# EAGLE design finalproject_2 (EAGLE 9.6.2)
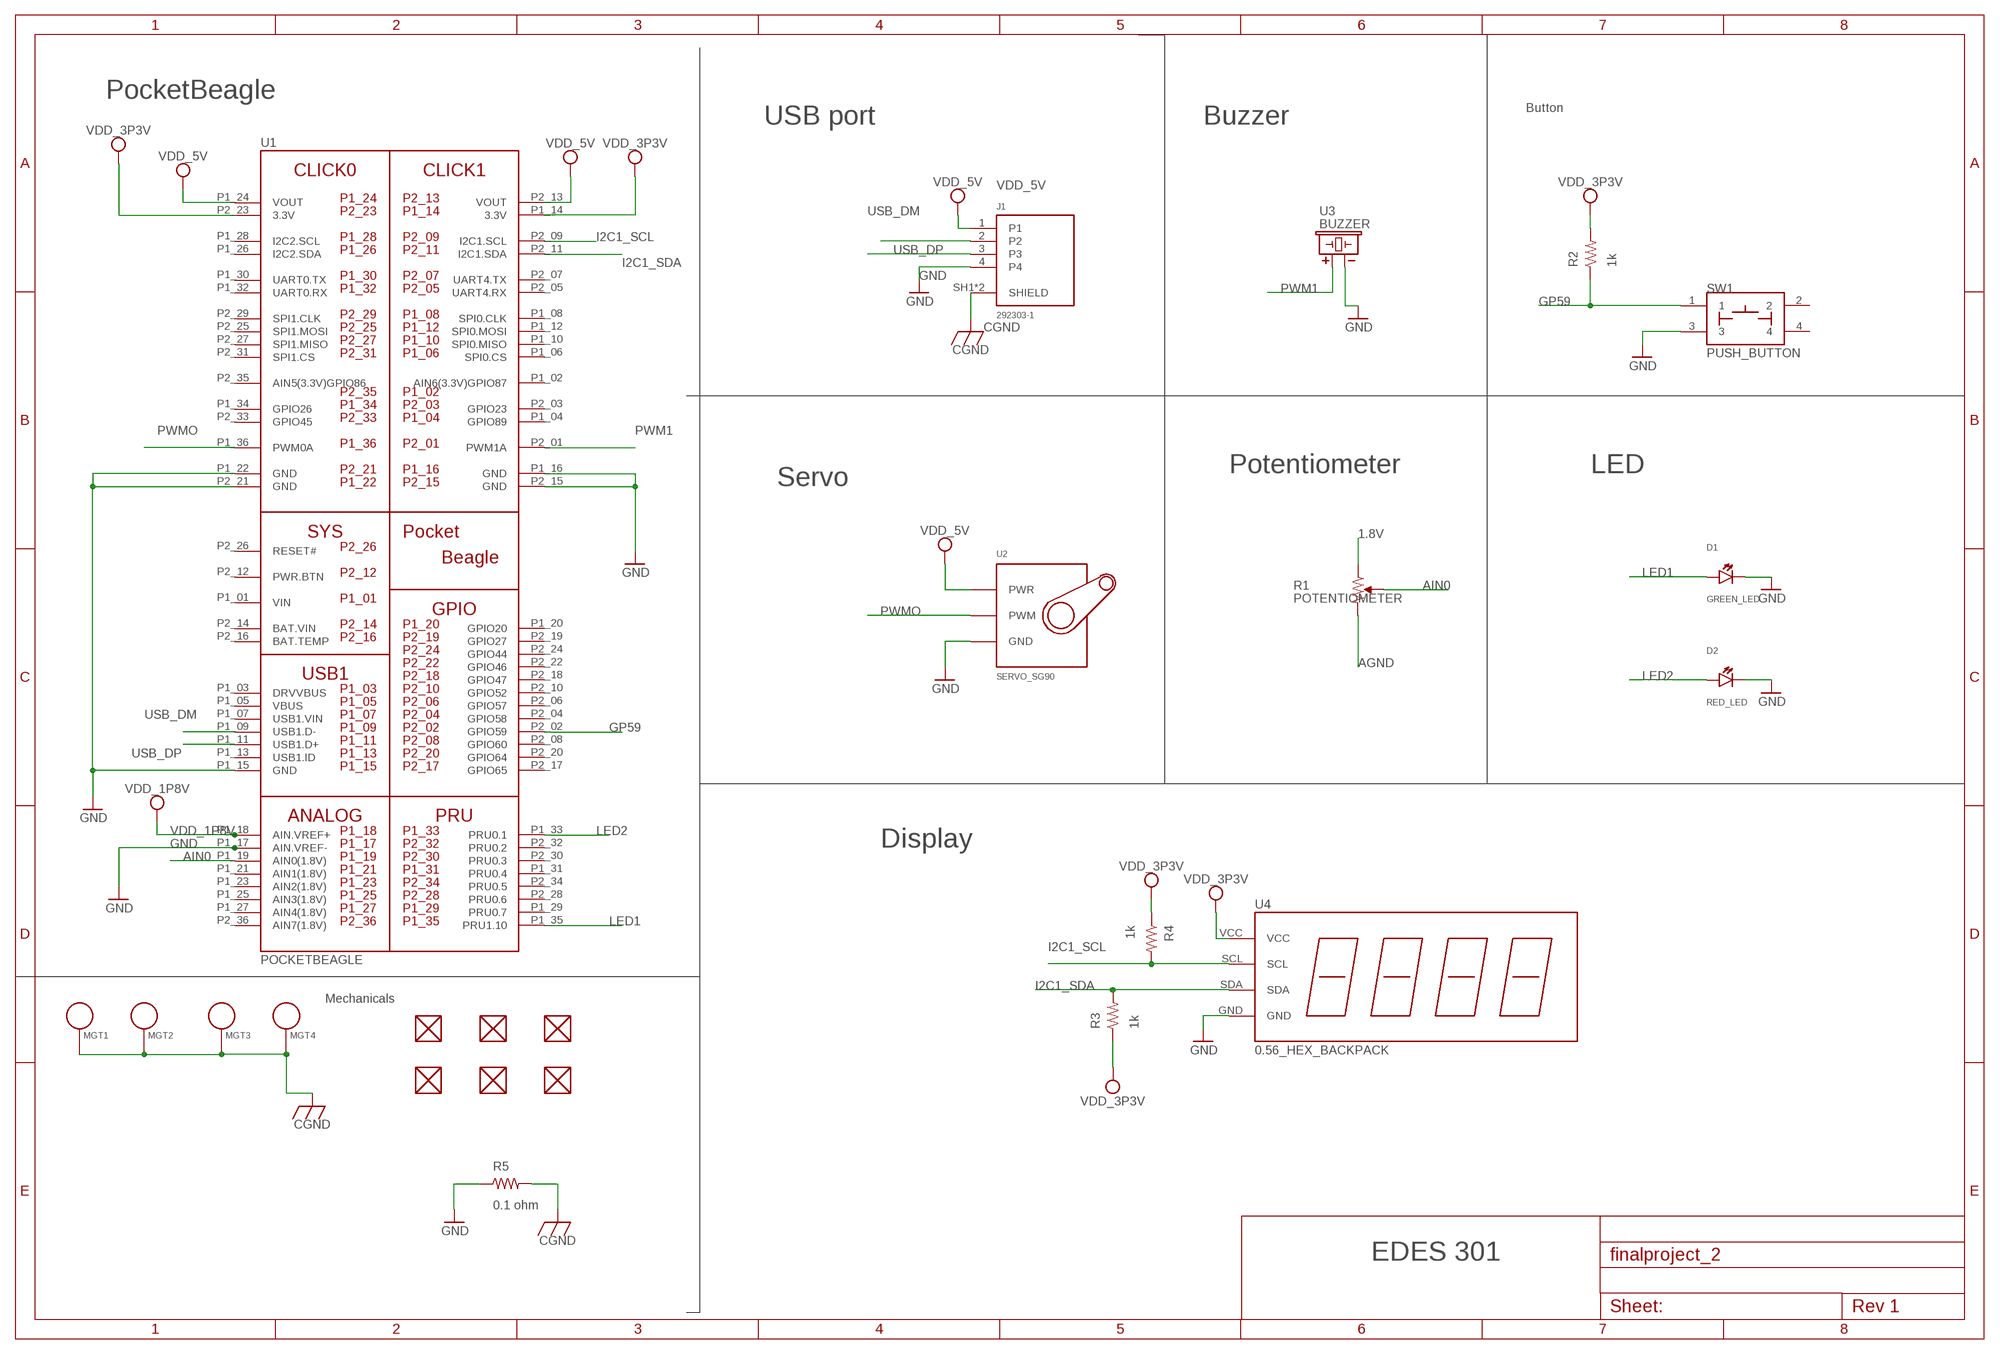
[diagram p0: schematic, sheet 1]

## Parts
D1  GREEN_LED  LED  [EIA-STD]
D2  RED_LED  LED  [EIA-STD]
FUD1  FIDUCIAL  [FIDUCIAL_40MIL]
FUD2  FIDUCIAL  [FIDUCIAL_40MIL]
FUD3  FIDUCIAL  [FIDUCIAL_40MIL]
FUD4  FIDUCIAL  [FIDUCIAL_40MIL]
FUD5  FIDUCIAL  [FIDUCIAL_40MIL]
FUD6  FIDUCIAL  [FIDUCIAL_40MIL]
J1  292303-1  [TE_292303-1]
MGT1  MOUNTING_HOLE  [MOUNTING_HOLE]
MGT2  MOUNTING_HOLE  [MOUNTING_HOLE]
MGT3  MOUNTING_HOLE  [MOUNTING_HOLE]
MGT4  MOUNTING_HOLE  [MOUNTING_HOLE]
R1  POTENTIOMETER  [POT-PO90S]
R2  1k  R_R0402  [R0402]
R3  1k  R_R0402  [R0402]
R4  1k  R_R0402  [R0402]
R5  0.1 ohm  R_R0805  [R0805]
SW1  PUSH_BUTTON  [BUTTON_12.5MM]
U1  POCKETBEAGLE  [POCKETBEAGLE]
U2  SERVO_SG90  [SERVO-X1]
U3  BUZZER  [BUZZER_6.5MM]
U4  0.56_HEX_BACKPACK  [0.56_HEX_BACKPACK]

## Nets
1.8V: R1.CCW
AGND: R1.CW
AIN0: R1.S U1.P1_19(AIN0(1.8V))
CGND: J1.SH1(SHIELD) J1.SH2(SHIELD) MGT1.P$1 MGT2.P$1 MGT3.P$1 MGT4.P$1 R5.2
GND: D1.CATHODE D2.CATHODE J1.4 R5.1 SW1.3 U1.P1_15(GND) U1.P1_16(GND) U1.P1_17(AIN.VREF-) U1.P1_22(GND) U1.P2_15(GND) U1.P2_21(GND) U2.GND U3.- U4.GND
GP59: R2.1 SW1.1 U1.P2_02(GPIO59)
I2C1_SCL: R4.2 U1.P2_09(I2C1.SCL) U4.SCL
I2C1_SDA: R3.2 U1.P2_11(I2C1.SDA) U4.SDA
LED1: D1.ANODE U1.P1_35(PRU1.10)
LED2: D2.ANODE U1.P1_33(PRU0.1)
PWM1: U1.P2_01(PWM1A) U3.+
PWMO: U1.P1_36(PWM0A) U2.SIG(PWM)
USB_DM: J1.2 U1.P1_09(USB1.D-)
USB_DP: J1.3 U1.P1_11(USB1.D+)
VDD_1P8V: U1.P1_18(AIN.VREF+)
VDD_3P3V: R2.2 R3.1 R4.1 U1.P1_14(3.3V) U1.P2_23(3.3V) U4.VCC
VDD_5V: J1.1 U1.P1_24(VOUT) U1.P2_13(VOUT) U2.PWR
Unconnected: FUD1.P$1 FUD2.P$1 FUD3.P$1 FUD4.P$1 FUD5.P$1 FUD6.P$1 SW1.2 SW1.4 U1.P1_02(AIN6(3.3V)GPIO87) U1.P1_03(DRVVBUS) U1.P1_04(GPIO89) U1.P1_05(VBUS) U1.P1_06(SPI0.CS) U1.P1_07(USB1.VIN) U1.P1_08(SPI0.CLK) U1.P1_10(SPI0.MISO) U1.P1_12(SPI0.MOSI) U1.P1_13(USB1.ID) U1.P1_20(GPIO20) U1.P1_21(AIN1(1.8V)) U1.P1_23(AIN2(1.8V)) U1.P1_25(AIN3(1.8V)) U1.P1_26(I2C2.SDA) U1.P1_27(AIN4(1.8V)) U1.P1_28(I2C2.SCL) U1.P1_29(PRU0.7) U1.P1_30(UART0.TX) U1.P1_31(PRU0.4) U1.P1_32(UART0.RX) U1.P1_34(GPIO26) U1.P2_03(GPIO23) U1.P2_04(GPIO58) U1.P2_05(UART4.RX) U1.P2_06(GPIO57) U1.P2_07(UART4.TX) U1.P2_08(GPIO60) U1.P2_10(GPIO52) U1.P2_12(PWR.BTN) U1.P2_16(BAT.TEMP) U1.P2_17(GPIO65) U1.P2_18(GPIO47) U1.P2_19(GPIO27) U1.P2_20(GPIO64) U1.P2_22(GPIO46) U1.P2_24(GPIO44) U1.P2_25(SPI1.MOSI) U1.P2_26(RESET#) U1.P2_27(SPI1.MISO) U1.P2_28(PRU0.6) U1.P2_29(SPI1.CLK) U1.P2_30(PRU0.3) U1.P2_31(SPI1.CS) U1.P2_32(PRU0.2) U1.P2_33(GPIO45) U1.P2_34(PRU0.5) U1.P2_35(AIN5(3.3V)GPIO86) U1.P2_36(AIN7(1.8V))

## Notes on the sheet
- PocketBeagle
- Button
- USB port | Buzzer
- Potentiometer | LED
- Servo
- Display
- Mechanicals
- EDES 301

## Power pins joined to a net without a drawn wire
BAT.VIN: U1.P2_14(BAT.VIN)
VIN: U1.P1_01(VIN)

## Library data of the parts
D1 D2 = combo_lock (2):LED: EIA-STD LED, LTST-C191TBKT
FUD1-FUD6 = MISC (1):FIDUCIAL
J1 = 292303-1:292303-1: Check availability <https://pricing.snapeda.com/parts/292303-1/TE%20Connectivity/view-part?ref=eda>; AVAILABILITY: In Stock; CENTERLINE_PITCH: 2 mm[.078 in]; CHECK_PRICES: https://www.snapeda.com/parts/292303-1/TE+Connectivity+AMP+Connectors/view-part/?ref=eda; COMMENT: 292303-1; DESCRIPTION: Type A Standard USB Connector 4 Position Right Angle Mount 1 Port | TE Connectivity 292303-1; EU_ROHS_COMPLIANCE: Compliant; MF: TE Connectivity; MP: 292303-1; NUMBER_OF_POSITIONS: 4; PACKAGE: None; PRICE: None; PRODUCT_TYPE: Connector; SNAPEDA_LINK: https://www.snapeda.com/parts/292303-1/TE+Connectivity+AMP+Connectors/view-part/?ref=snap
MGT1-MGT4 = MISC (1):MOUNTING_HOLE: Chassis Mounting Hole w/GND connection ability
R1 = combo_lock (2):POTENTIOMETER: Potentiometer - Examples: P090S-14T20BR10K (987-1277-ND)
R2-R5 = combo_lock (2):R_: RESISTOR, American symbol
SW1 = combo_lock (2):PUSH_BUTTON
U1 = combo_lock (2):POCKETBEAGLE
U2 = combo_lock (2):SERVO_SG90
U3 = combo_lock (2):BUZZER: CEM-1203 Buzzer
U4 = combo_lock (2):0.56_HEX_BACKPACK: 0.56" LED HEX Backback - Adafruit HT16K33 - https://www.adafruit.com/product/878 - https://www.adafruit.com/product/879 - https://www.adafruit.com/product/880 - https://www.adafruit.com/product/881 - https://www.adafruit.com/product/1002

## Board
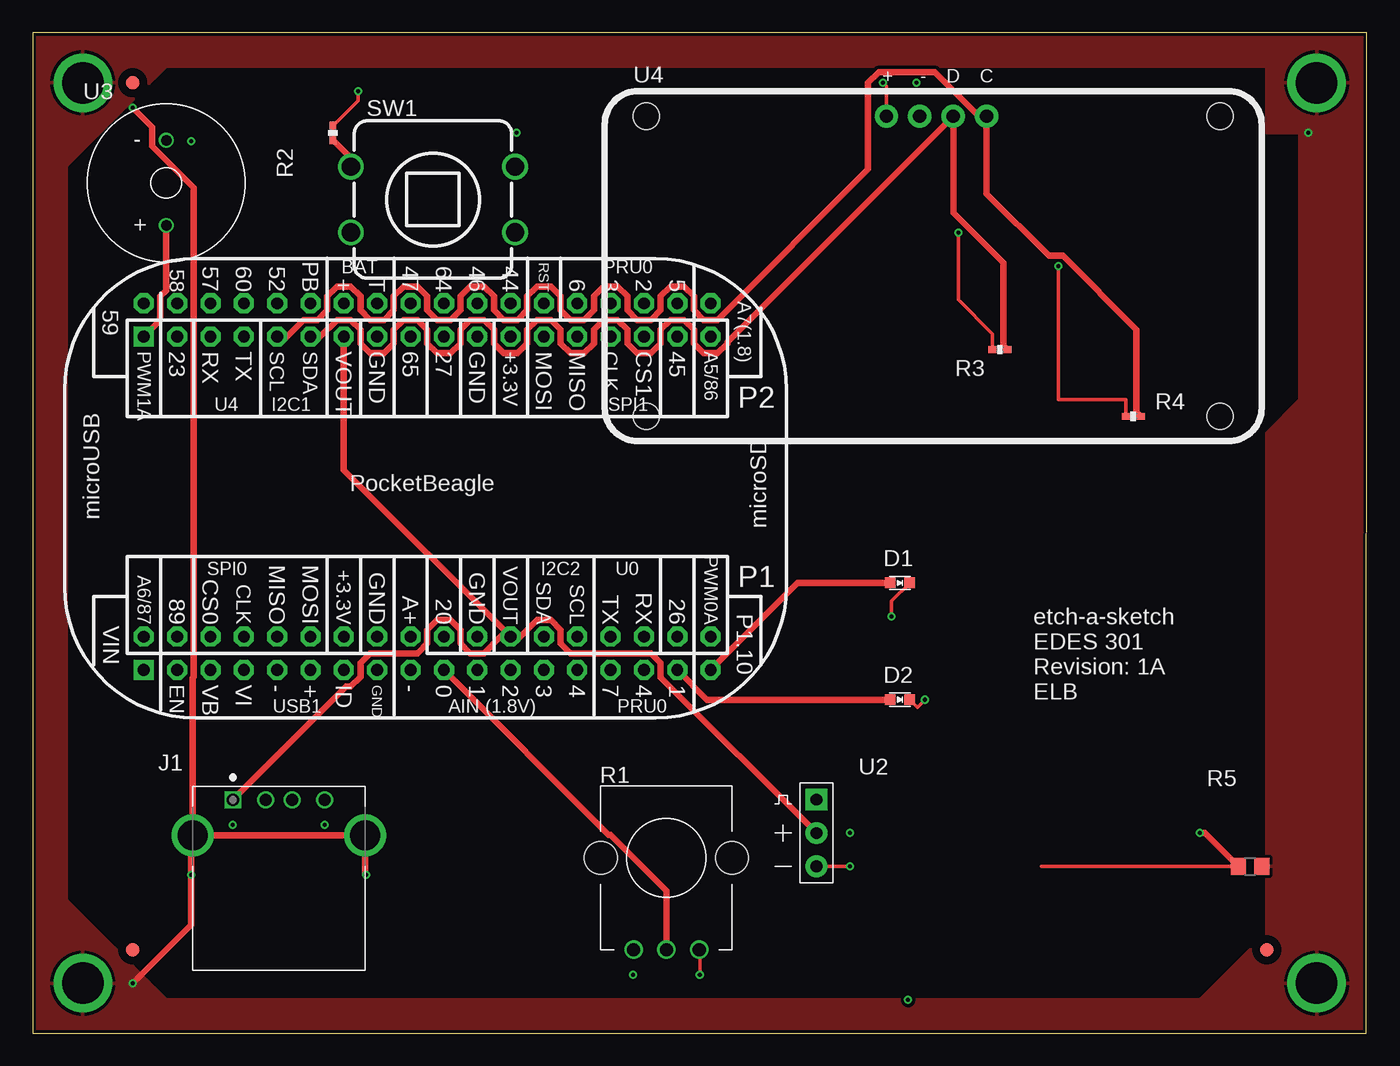
[diagram p1: board, top side]
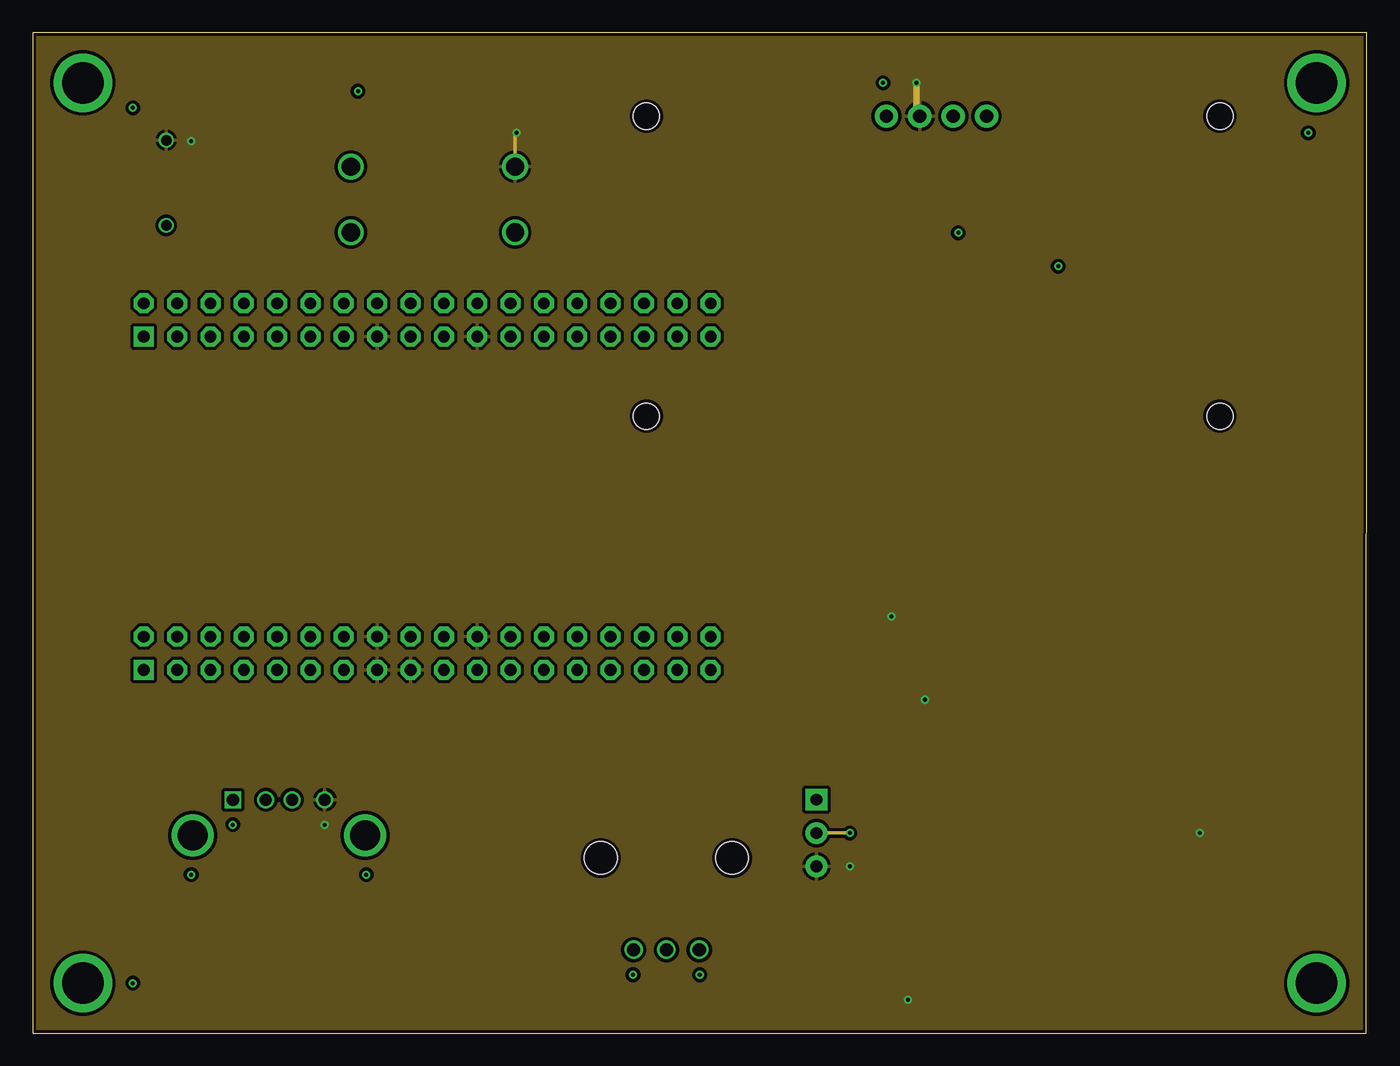
[diagram p2: board, inner layer Route2]
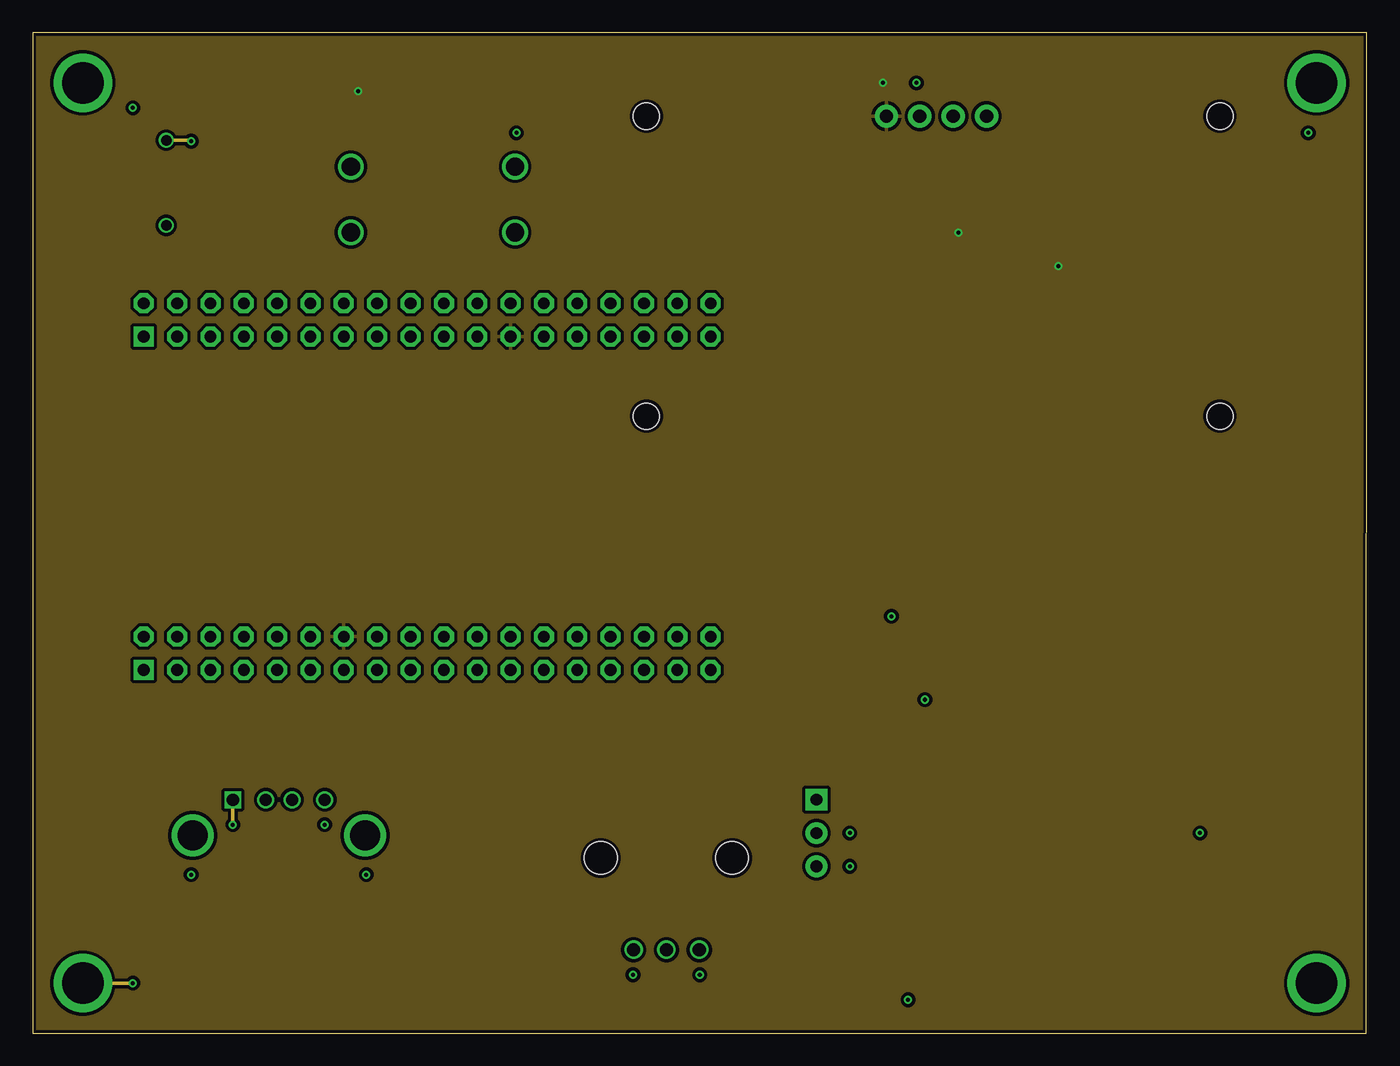
[diagram p3: board, inner layer Route15]
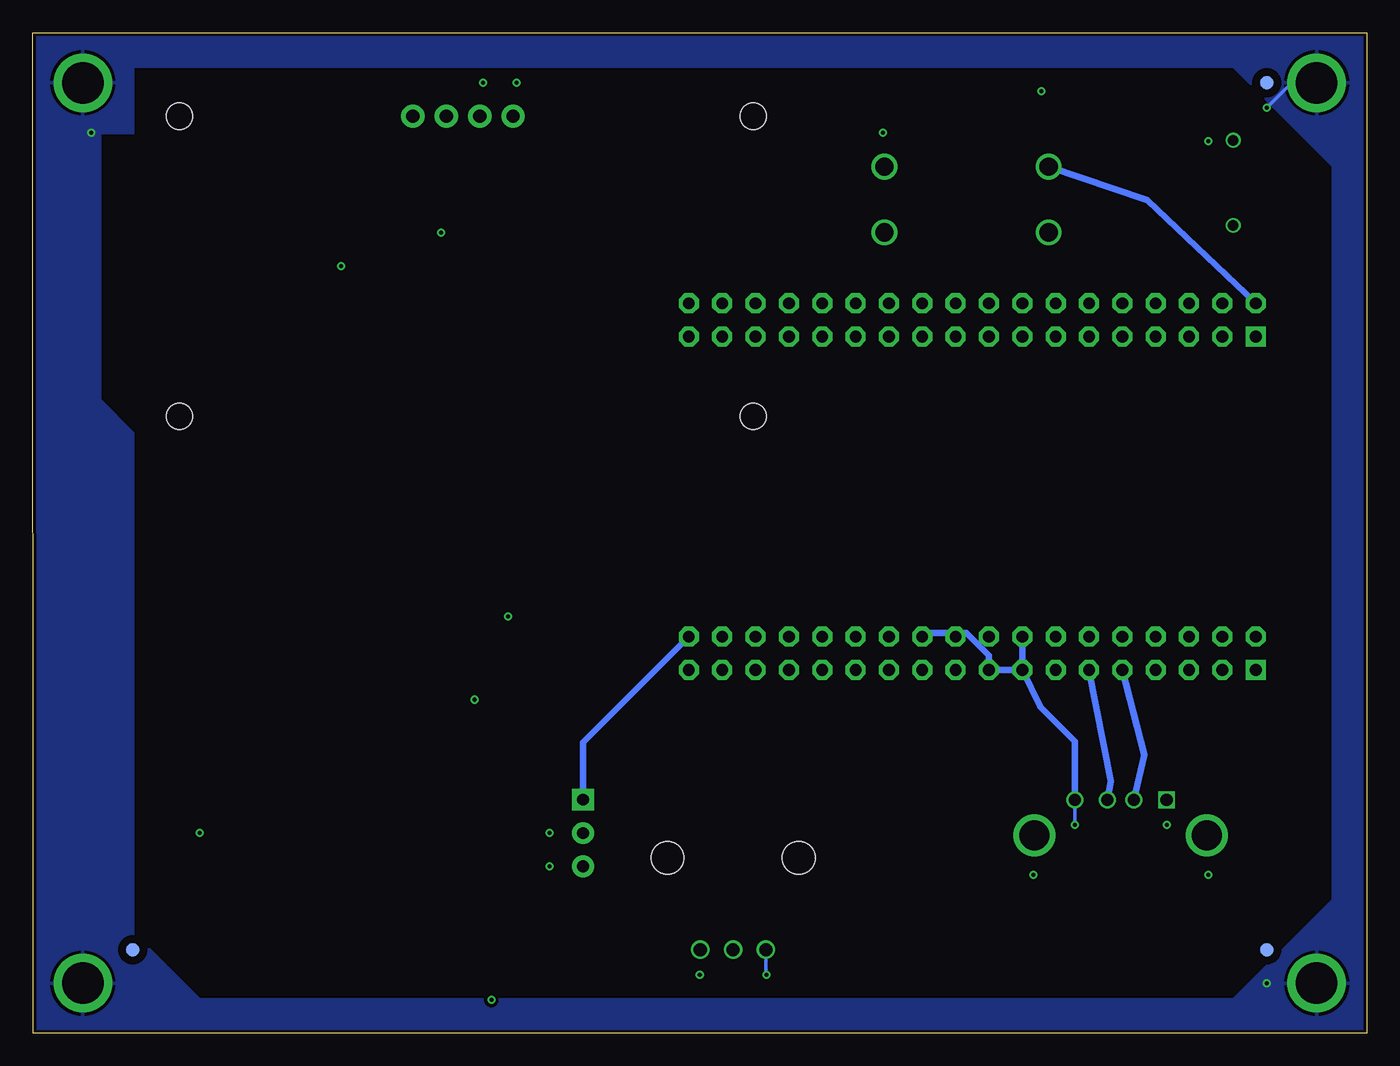
[diagram p4: board, bottom side, seen from below]

Size 101.6 x 76.2 mm. Coordinates in mm from the lower left corner, seen from the top.
Outline: 0,0 101.58,0 101.6,76.2 0,76.2 0,0
Copper layers (1*2*15*16): Top 0.035mm / dielectric 0.23mm / Route2 0.035mm / dielectric 0.93mm / Route15 0.035mm / dielectric 0.23mm / Bottom 0.035mm
Design rules "ENGI301_4lyr": minimum track width 10mil, minimum drill 12mil, track to track 10mil, track to pad 10mil, pad to pad 10mil, via to via 10mil, smd to smd 10mil, copper to edge 10mil, drill to drill 12mil, minimum pad ring 6mil, minimum via ring 6mil, stop-mask expansion 3mil, vias tented up to drill 25mil, thermal gap 10mil

### Footprints (pad centres in the part's own frame; a part is rotated, then mirrored left to right if it is on the bottom)
EIA-STD = smd 0.8 x 0.8: ANODE -0.75,0; CATHODE 0.75,0
FIDUCIAL_40MIL = smd 1.016 x 1.016: P$1 0,0
TE_292303-1 = drill 0.92 square: 1 0,0 | drill 0.92: 2 2.5,0; 3 4.5,0; 4 7,0 | drill 2.3: SH1 -3.07,-2.71; SH2 10.07,-2.71
MOUNTING_HOLE = drill 3.175 pad 4.445: P$1 0,0
POT-PO90S = drill 1: CCW -2.5,0; CW 2.5,0; S 0,0 | hole 2.5: -5,7; 5,7
R0402 = smd 0.61 x 0.508: 1 -0.559,0; 2 0.559,0
R0805 = smd 1.143 x 1.27: 1 -0.889,0; 2 0.889,0
BUTTON_12.5MM = drill 1.4: 1 -6.25,2.5; 2 -6.25,-2.5; 3 6.25,2.5; 4 6.25,-2.5
POCKETBEAGLE = drill 0.889 pad 1.524 square: P1_01 5.91,3.53; P2_01 5.91,28.93 | drill 0.889 pad 1.524 octagon: P1_02 5.91,6.07; P1_03 8.45,3.53; P1_04 8.45,6.07; P1_05 10.99,3.53; P1_06 10.99,6.07; P1_07 13.53,3.53; P1_08 13.53,6.07; P1_09 16.07,3.53; P1_10 16.07,6.07; P1_11 18.61,3.53; P1_12 18.61,6.07; P1_13 21.15,3.53; P1_14 21.15,6.07; P1_15 23.69,3.53; P1_16 23.69,6.07; P1_17 26.23,3.53; P1_18 26.23,6.07; P1_19 28.77,3.53; P1_20 28.77,6.07; P1_21 31.31,3.53; P1_22 31.31,6.07; P1_23 33.85,3.53; P1_24 33.85,6.07; P1_25 36.39,3.53; P1_26 36.39,6.07; P1_27 38.93,3.53; P1_28 38.93,6.07; P1_29 41.47,3.53; P1_30 41.47,6.07; P1_31 44.01,3.53; P1_32 44.01,6.07; P1_33 46.55,3.53; P1_34 46.55,6.07; P1_35 49.09,3.53; P1_36 49.09,6.07; P2_02 5.91,31.47; P2_03 8.45,28.93; P2_04 8.45,31.47; P2_05 10.99,28.93; P2_06 10.99,31.47; P2_07 13.53,28.93; P2_08 13.53,31.47; P2_09 16.07,28.93; P2_10 16.07,31.47; P2_11 18.61,28.93; P2_12 18.61,31.47; P2_13 21.15,28.93; P2_14 21.15,31.47; P2_15 23.69,28.93; P2_16 23.69,31.47; P2_17 26.23,28.93; P2_18 26.23,31.47; P2_19 28.77,28.93; P2_20 28.77,31.47; P2_21 31.31,28.93; P2_22 31.31,31.47; P2_23 33.85,28.93; P2_24 33.85,31.47; P2_25 36.39,28.93; P2_26 36.39,31.47; P2_27 38.93,28.93; P2_28 38.93,31.47; P2_29 41.47,28.93; P2_30 41.47,31.47; P2_31 44.01,28.93; P2_32 44.01,31.47; P2_33 46.55,28.93; P2_34 46.55,31.47; P2_35 49.09,28.93; P2_36 49.09,31.47
SERVO-X1 = drill 0.889 pad 1.651: GND 0,-2.54; PWR 0,0 | drill 0.889 pad 1.651 square: SIG 0,2.54
BUZZER_6.5MM = drill 0.8: + 0,-3.25; - 0,3.25
0.56_HEX_BACKPACK = drill 1.016 pad 1.778: GND -1.016,11.43; SCL 4.064,11.43; SDA 1.524,11.43; VCC -3.556,11.43 | hole 2: -21.844,-11.43; 21.844,-11.43; -21.844,11.43; 21.844,11.43

### Placement (x,y rotation side)
D1  66.04,34.29 0 top
D2  66.04,25.4 0 top
FUD1  7.62,6.35 0 top
FUD2  7.62,72.39 0 bottom
FUD3  7.62,72.39 0 top
FUD4  7.62,6.35 0 bottom
FUD5  93.98,6.35 0 bottom
FUD6  93.98,6.35 0 top
J1  15.24,17.78 0 top
MGT1  3.81,3.81 0 top
MGT2  3.81,72.39 0 top
MGT3  97.79,72.39 0 top
MGT4  97.79,3.81 0 top
R1  48.26,6.35 0 top
R2  22.86,68.58 90 top
R3  73.66,52.07 0 top
R4  83.82,46.99 0 top
R5  92.71,12.7 0 top
SW1  30.48,63.5 0 top
U1  2.54,24.13 0 top
U2  59.69,15.24 0 top
U3  10.16,64.77 0 top
U4  68.58,58.42 0 top

### Tracks (layer width: path | path; a pad name or v marks a point on that pad's centre or on a via)
1.8V  (via drill 0.3 pad 0.61)
  Bottom 0.254: R1.CCW 45.76,4.49 v45.72,4.45
AGND  (via drill 0.3 pad 0.61)
  Top 0.254: R1.CW 50.8,6.31 v50.8,4.45
AIN0
  Top 0.508: U1.P1_19 43.86,15.11 43.99,15.11 48.26,10.84 R1.S
CGND  (via drill 0.3 pad 0.61)
  Top 0.254: v12.06,12.06 12.17,12.17 | 93.98,12.32 R5.2
  Top 0.508: v7.62,3.81 12.06,8.26 v12.06,12.06 12.06,14.96 J1.SH1 | J1.SH1 14.9,15.07 14.9,15.06 J1.SH2 25.31,12.15 v25.4,12.06 | J1.SH1 12.17,27.04 12.26,27.13 12.26,64.41 9.09,67.58 9.09,69.01 v7.62,70.48
  Route15 0.254: MGT1.P$1 v7.62,3.81
  Bottom 0.254: MGT2.P$1 5.71,72.39 v7.62,70.48
  other vias: 97.16,68.58
  pour Top: 116.84,40.64 93.98,40.64 93.98,7.62 91.44,5.08 88.9,2.54 10.16,2.54 2.54,10.16 2.54,38.1 -12.7,38.1 -12.7,-12.7 119.38,-12.7 119.38,40.64
  pour Top: 93.98,40.64 93.98,45.72 96.52,48.26 96.52,68.58 93.98,68.58 93.98,73.66 10.16,73.66 5.08,68.58 2.54,66.04 2.54,38.1 -12.7,38.1 -12.7,86.36 119.38,86.36 119.38,40.64
  pour Bottom: 2.54,38.1 2.54,10.16 10.16,2.54 66.04,2.54 88.9,2.54 93.98,7.62 93.98,40.64 129.54,40.64 129.54,-20.32 127,-17.78 -20.32,-17.78 -17.78,-15.24 -17.78,38.1
  pour Bottom: 2.54,38.1 2.54,66.04 10.16,73.66 93.98,73.66 93.98,68.58 96.52,68.58 96.52,48.26 93.98,45.72 93.98,40.64 129.54,40.64 129.54,91.44 -15.24,91.44 -17.78,88.9 -17.78,38.1
GND  (via drill 0.3 pad 0.61)
  Top 0.254: U2.GND v62.23,12.7 | R5.1 76.83,12.7 | D1.CATHODE 65.41,32.91 v65.41,31.75 | D2.CATHODE 67.37,24.82 v67.94,25.4
  Top 0.508: R5.1 89.28,15.24 v88.9,15.24
  Route2 0.254: SW1.3 36.73,68.48 v36.83,68.58
  Route2 0.508: U4.GND 67.31,70.1 v67.31,72.39
  Route15 0.254: U3.- 11.99,68.02 v12.06,67.94
  Bottom 0.254: J1.4 v22.24,15.89 v22.23,15.88
  Bottom 0.508: U1.P1_15 24.84,24.84 22.24,22.24 J1.4 | U1.P1_15 U1.P1_17 28.77,28.77 30.48,30.48 33.57,30.48 U1.P1_22 | U1.P1_15 U1.P1_16
  other vias: 66.67,2.54
  pour Route2: -5.08,-5.08 -5.08,81.28 104.14,81.28 106.68,81.28 106.68,-5.08
GP59
  Top 0.508: SW1.1 24.23,66.65 R2.1
  Bottom 0.508: U1.P2_02 16.71,63.46 SW1.1
I2C1_SCL
  Top 0.508: R4.2 84.07,47.3 84.07,53.6 78.44,59.23 77.38,59.23 72.64,63.96 U4.SCL 72.08,69.85 68.73,73.2 64.43,73.2 63.63,72.4 63.63,65.8 52.16,54.33 51.1,54.33 50.36,55.07 50.36,56.13 49.62,56.87 48.56,56.87 47.82,56.13 47.82,55.07 47.08,54.33 46.02,54.33 45.28,55.07 45.28,56.13 44.54,56.87 43.48,56.87 42.74,56.13 42.74,55.07 42,54.33 40.94,54.33 40.2,55.07 40.2,56.13 39.46,56.87 38.4,56.87 37.66,56.13 37.66,55.07 36.92,54.33 35.86,54.33 35.12,55.07 35.12,56.13 34.38,56.87 33.32,56.87 32.58,56.13 32.58,55.07 31.84,54.33 30.78,54.33 30.04,55.07 30.04,56.13 29.3,56.87 28.24,56.87 27.5,56.13 27.5,55.07 26.76,54.33 25.7,54.33 24.96,55.07 24.96,56.13 24.22,56.87 23.16,56.87 22.42,56.13 22.42,55.07 21.68,54.33 20.62,54.33 19.35,53.06 U1.P2_09
I2C1_SDA
  Top 0.508: R3.2 73.91,52.38 73.91,58.68 70.1,62.49 U4.SDA 52.9,52.65 52.9,52.53 52.16,51.79 51.1,51.79 50.36,52.53 50.36,53.59 49.62,54.33 48.56,54.33 47.82,53.59 47.82,52.53 47.08,51.79 46.02,51.79 45.28,52.53 45.28,53.59 44.54,54.33 43.48,54.33 42.74,53.59 42.74,52.53 42,51.79 40.94,51.79 40.2,52.53 40.2,53.59 39.46,54.33 38.4,54.33 37.66,53.59 37.66,52.53 36.92,51.79 35.86,51.79 35.12,52.53 35.12,53.59 34.38,54.33 33.32,54.33 32.58,53.59 32.58,52.53 31.84,51.79 30.78,51.79 30.04,52.53 30.04,53.59 29.3,54.33 28.24,54.33 27.5,53.59 27.5,52.53 26.76,51.79 25.7,51.79 24.96,52.53 24.96,53.59 24.22,54.33 23.16,54.33 21.89,53.06 U1.P2_11
LED1
  Top 0.508: D1.ANODE 58.26,34.29 U1.P1_35
LED2
  Top 0.508: D2.ANODE 51.35,25.4 U1.P1_33
PWM1
  Top 0.508: U3.+ 10.16,56.57 9.72,56.13 9.72,54.33 U1.P2_01
PWMO
  Bottom 0.508: U1.P1_36 59.69,22.14 U2.SIG
USB_DM
  Bottom 0.508: U1.P1_09 16.95,21.19 J1.2
USB_DP
  Bottom 0.508: U1.P1_11 19.49,19.19 J1.3
VDD_3P3V  (via drill 0.3 pad 0.61)
  Top 0.254: v70.48,60.96 70.48,55.88 73.1,53.26 R3.1 | v78.11,58.42 78.11,48.26 83.26,48.26 R4.1 | v64.77,72.39 65.02,72.14 U4.VCC | v24.77,71.75 24.77,71.04 R2.2
  pour Route15 (rank 6): -7.62,-7.62 -7.62,83.82 109.22,83.82 109.22,-7.62
VDD_5V  (via drill 0.3 pad 0.61)
  Top 0.508: U1.P1_24 23.69,42.9 U1.P2_13 | U1.P1_24 37.13,30.2 38.4,31.47 39.46,31.47 40.2,30.73 40.2,29.67 40.94,28.93 47.08,28.93 47.82,28.19 47.82,27.11 U2.PWR | J1.1 23.85,26.39 24.22,26.39 24.96,27.13 24.96,28.19 25.7,28.93 29.3,28.93 30.04,29.67 30.04,30.73 30.78,31.47 31.84,31.47 32.58,30.73 32.58,29.67 33.32,28.93 34.38,28.93 35.65,30.2 U1.P1_24
  Route2 0.254: U2.PWR v62.23,15.24
  Route15 0.254: J1.1 v15.24,15.88

### Text on the board
tPlace: etch-a-sketch / EDES 301 / Revision: 1A / ELB